# Altium project power_unit.PrjPcb
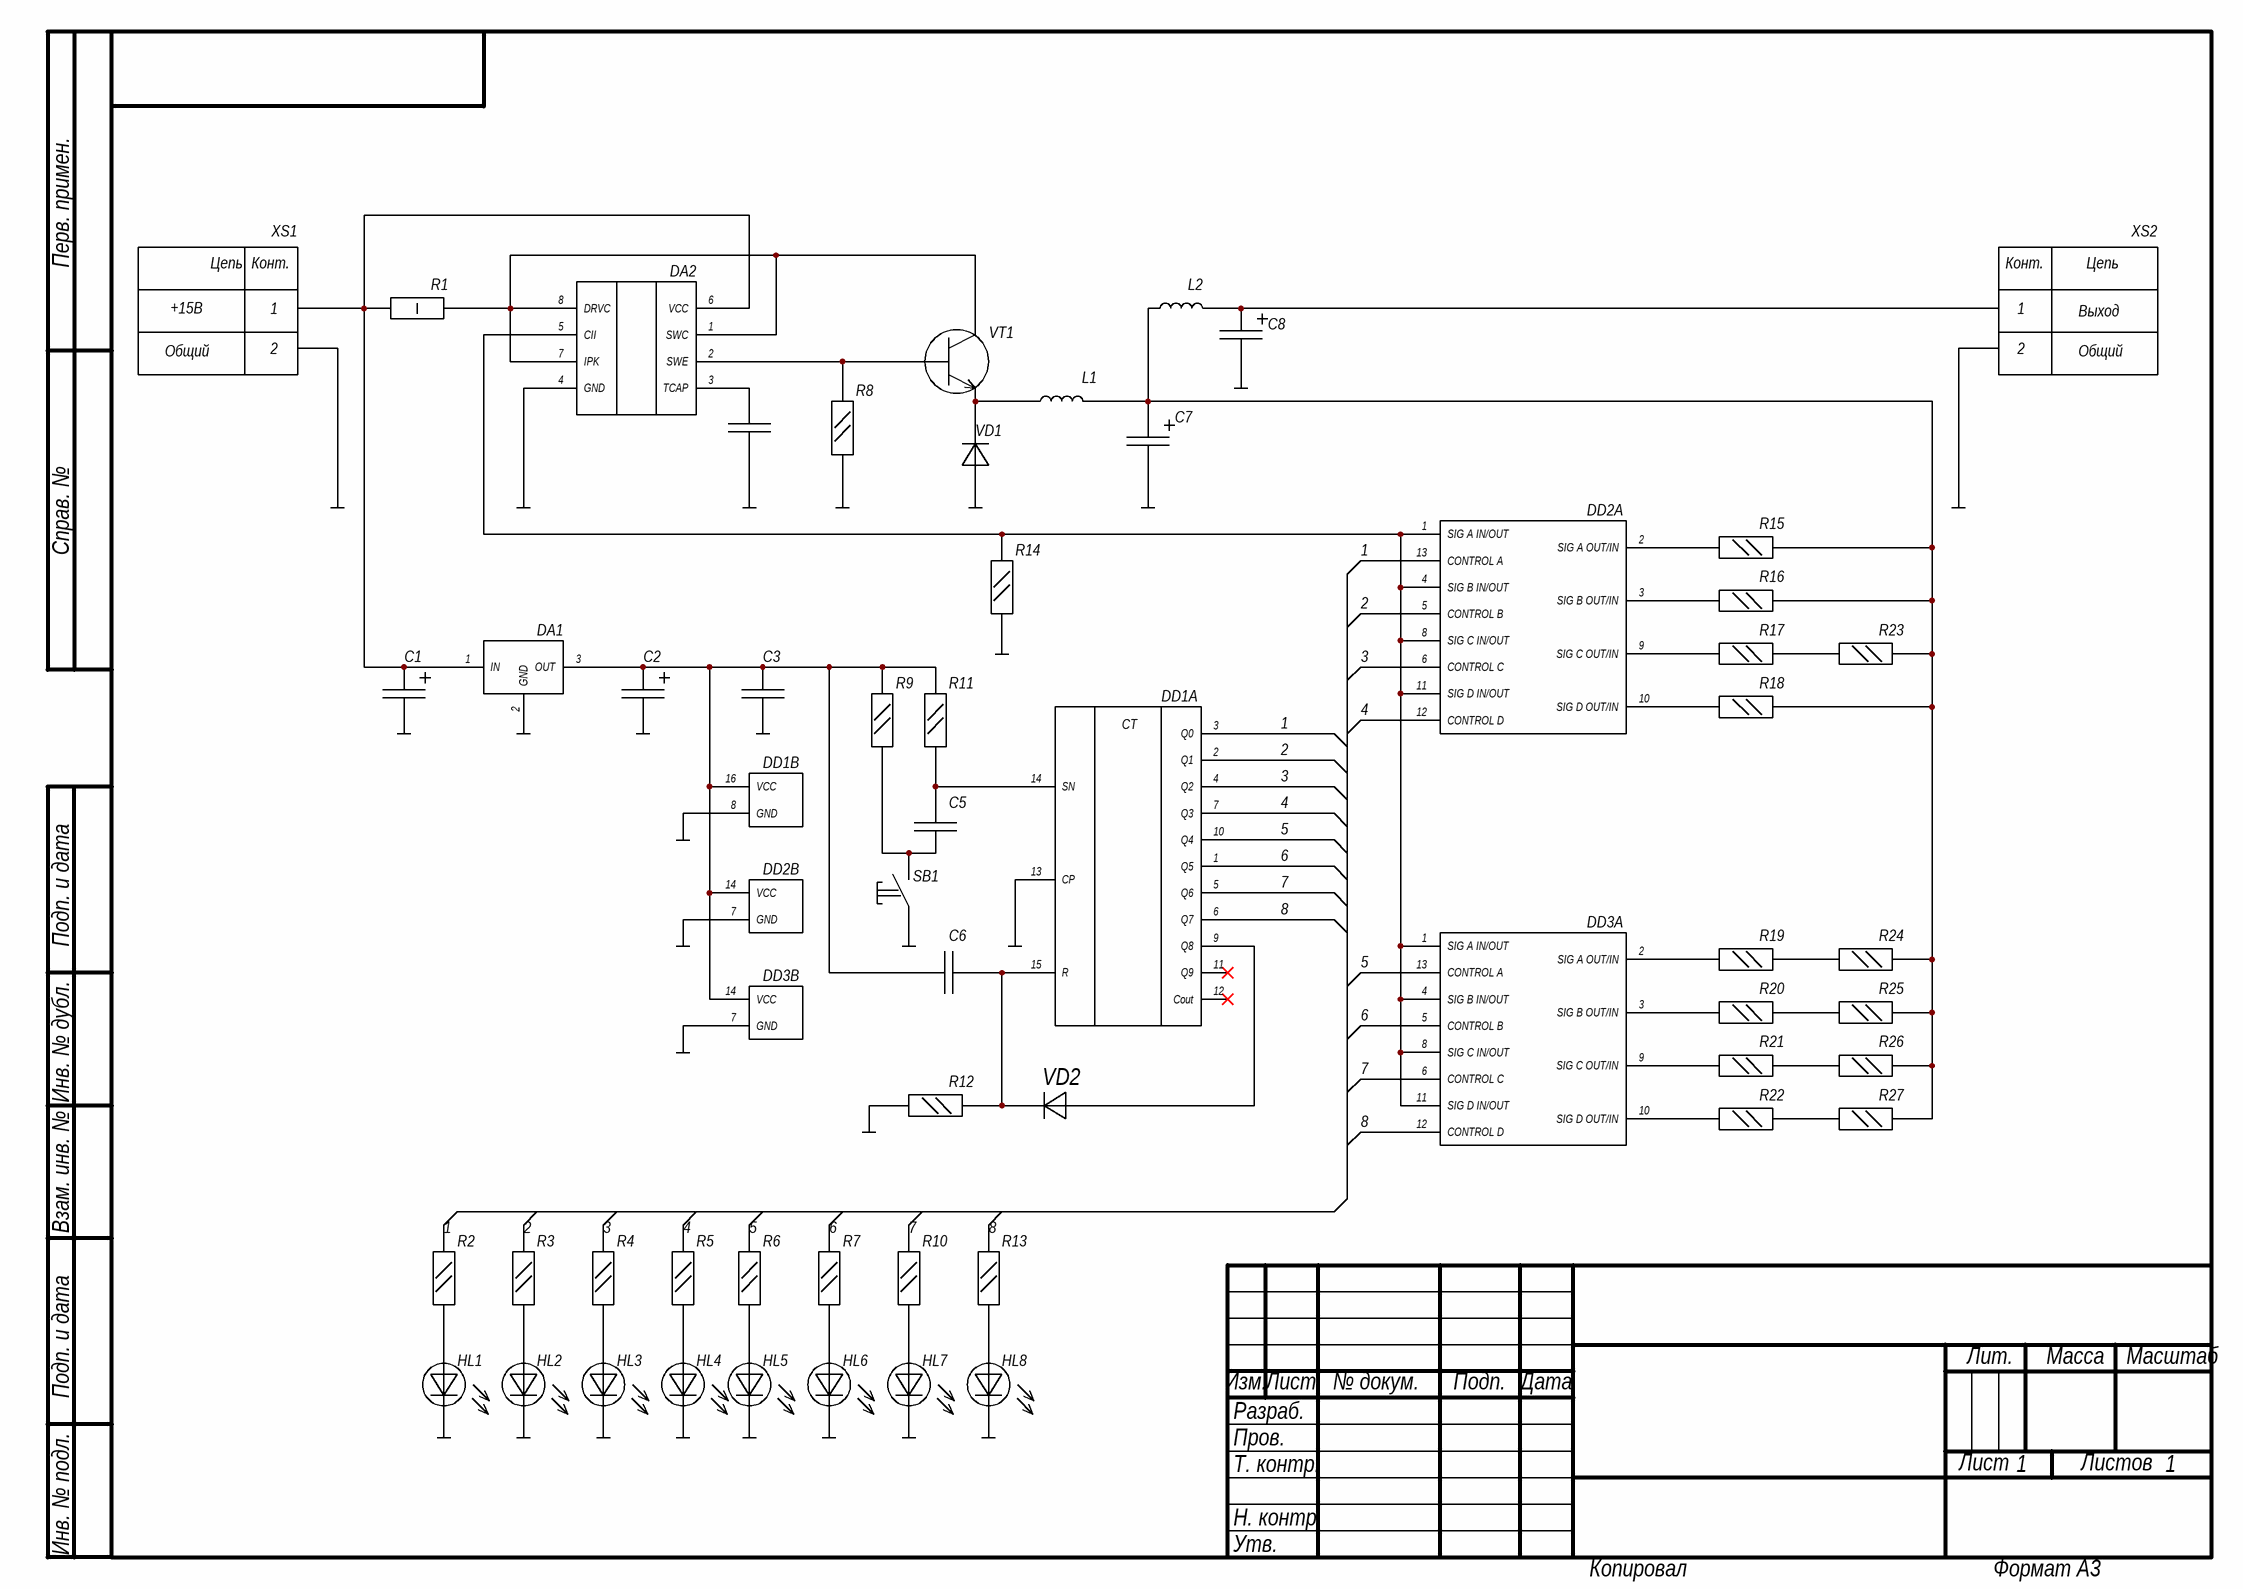
[diagram p0: Sch.SchDoc]
1 sheet, 56 parts. Net scope: global (net labels, ports and power ports of the same name join across sheets).
Board file: PCB.PcbDoc

## Sheet Sch.SchDoc
size 420 x 297 mm; SheetNumber: 1; SheetTotal: 1

### Parts
C1  100uF 25V  [CAPPR250-630X1120]  (value not drawn)
C2  100uF 25V  [CAPPR250-630X1120]  (value not drawn)
C3  Cap Ceramic 0.1uF  [CAPPRB508-450X850]  (value not drawn)
C4  Cap Ceramic 470pF  [CAPPRB508-450X850]  (value not drawn)
C5  Cap Ceramic 0.1uF  [CAPPRB508-450X850]  (value not drawn)
C6  Cap Ceramic 0.1uF  [CAPPRB508-450X850]  (value not drawn)
C7  470uF 25V  [CAPPR350-850X1300]  (value not drawn)
C8  470uF 25V  [CAPPR350-850X1300]  (value not drawn)
DA1  L7809ABV  [TO-220AB]  (value not drawn)
DA2  MC34063ABN  [DIPS8-300]  (value not drawn)
DD1  CD4017BE  [DIPS16-300]  (value not drawn)  (parts A,B of 2)
DD2  CD4066BE  [DIPS14-300]  (value not drawn)  (parts A,B of 2)
DD3  CD4066BE  [DIPS14-300]  (value not drawn)  (parts A,B of 2)
HL1  LED Red  [LD-5mm-R]  (value not drawn)
HL2  LED Red  [LD-5mm-R]  (value not drawn)
HL3  LED Red  [LD-5mm-R]  (value not drawn)
HL4  LED Red  [LD-5mm-R]  (value not drawn)
HL5  LED Red  [LD-5mm-R]  (value not drawn)
HL6  LED Red  [LD-5mm-R]  (value not drawn)
HL7  LED Red  [LD-5mm-R]  (value not drawn)
HL8  LED Red  [LD-5mm-R]  (value not drawn)
L1  КИ (КИГ) 3,0−100мкГн ±5%  [INDRD_WURTH_WE-TI]  (value not drawn)
L2  КИ (КИГ) 3,0−100мкГн ±5%  [INDRD_WURTH_WE-TI]  (value not drawn)
R1  0,1Ом  [Res 1W]  (value not drawn)
R2  1кОм  [Res 0.125W]  (value not drawn)
R3  1кОм  [Res 0.125W]  (value not drawn)
R4  1кОм  [Res 0.125W]  (value not drawn)
R5  1кОм  [Res 0.125W]  (value not drawn)
R6  1кОм  [Res 0.125W]  (value not drawn)
R7  1кОм  [Res 0.125W]  (value not drawn)
R8  22кОм  [Res 0.125W]  (value not drawn)
R9  100кОм  [Res 0.125W]  (value not drawn)
R10  1кОм  [Res 0.125W]  (value not drawn)
R11  100кОм  [Res 0.125W]  (value not drawn)
R12  100кОм  [Res 0.125W]  (value not drawn)
R13  1кОм  [Res 0.125W]  (value not drawn)
R14  1кОм  [Res 0.125W]  (value not drawn)
R15  270Ом  [Res 0.125W]  (value not drawn)
R16  1кОм  [Res 0.125W]  (value not drawn)
R17  2кОм  [Res 0.125W]  (value not drawn)
R18  3,9кОм  [Res 0.125W]  (value not drawn)
R19  4,3кОм  [Res 0.125W]  (value not drawn)
R20  5,6кОм  [Res 0.125W]  (value not drawn)
R21  7,5кОм  [Res 0.125W]  (value not drawn)
R22  9,1кОм  [Res 0.125W]  (value not drawn)
R23  100Ом  [Res 0.125W]  (value not drawn)
R24  200Ом  [Res 0.125W]  (value not drawn)
R25  200Ом  [Res 0.125W]  (value not drawn)
R26  100Ом  [Res 0.125W]  (value not drawn)
R27  300Ом  [Res 0.125W]  (value not drawn)
SB1  Button SMD  [Button SMD]  (value not drawn)
VD1  1N5820  [DO-27]  (value not drawn)
VD2  1N4002  [DO-35]  (value not drawn)
VT1  TIP121G  [TO-220AB]  (value not drawn)
XS1  Power Connector 2 pin  [WIELAND_25.161.0253.0]  (value not drawn)
XS2  Power Connector 2 pin  [WIELAND_25.161.0253.0]  (value not drawn)

### Nets
GND: C1.2 C2.2 C3.2 C4.2 C7.2 C8.2 DA1.2(GND) DA2.4(GND) DD1.8(GND) DD1.13(CP) DD2.7(GND) DD3.7(GND) HL1.2(K) HL2.2(K) HL3.2(K) HL4.2(K) HL5.2(K) HL6.2(K) HL7.2(K) HL8.2(K) R8.1 R12.1 R14.1 SB1.1 VD1.1(А) XS1.2 XS2.2
1: DD1.3(Q0) DD2.13(CONTROL_A)
2: DD1.2(Q1) DD2.5(CONTROL_B)
3: DD1.4(Q2) DD2.6(CONTROL_C)
4: DD1.7(Q3) DD2.12(CONTROL_D)
5: DD1.10(Q4) DD3.13(CONTROL_A)
6: DD1.1(Q5) DD3.5(CONTROL_B)
7: DD1.5(Q6) DD3.6(CONTROL_C)
8: DD1.6(Q7) DD3.12(CONTROL_D)
NetC1_1: C1.1 DA1.1(IN) DA2.6(VCC) R1.2 XS1.1
NetC2_1: C2.1 C3.1 C6.1 DA1.3(OUT) DD1.16(VCC) DD2.14(VCC) DD3.14(VCC) R9.2 R11.2
NetC4_1: C4.1 DA2.3(TCAP)
NetC5_1: C5.1 DD1.14(SN) R11.1
NetC5_2: C5.2 R9.1 SB1.2
NetC6_2: C6.2 DD1.15(R) R12.2 VD2.2(К)
NetC7_1: C7.1 L1.2 L2.1 R15.2 R16.2 R18.2 R23.2 R24.2 R25.2 R26.2 R27.2
NetC8_1: C8.1 L2.2 XS2.1
NetDA2_1: DA2.1(SWC) DA2.7(IPK) DA2.8(DRVC) R1.1 VT1.2(К)
NetDA2_2: DA2.2(SWE) R8.2 VT1.1(Б)
NetDA2_5: DA2.5(CII) DD2.1(SIG_A_IN/OUT) DD2.4(SIG_B_IN/OUT) DD2.8(SIG_C_IN/OUT) DD2.11(SIG_D_IN/OUT) DD3.1(SIG_A_IN/OUT) DD3.4(SIG_B_IN/OUT) DD3.8(SIG_C_IN/OUT) DD3.11(SIG_D_IN/OUT) R14.2
NetDD1_9: DD1.9(Q8) VD2.1(А)
NetDD2_2: DD2.2(SIG_A_OUT/IN) R15.1
NetDD2_3: DD2.3(SIG_B_OUT/IN) R16.1
NetDD2_9: DD2.9(SIG_C_OUT/IN) R17.1
NetDD2_10: DD2.10(SIG_D_OUT/IN) R18.1
NetDD3_2: DD3.2(SIG_A_OUT/IN) R19.1
NetDD3_3: DD3.3(SIG_B_OUT/IN) R20.1
NetDD3_9: DD3.9(SIG_C_OUT/IN) R21.1
NetDD3_10: DD3.10(SIG_D_OUT/IN) R22.1
NetHL1_1: HL1.1(A) R2.1
NetHL2_1: HL2.1(A) R3.1
NetHL3_1: HL3.1(A) R4.1
NetHL4_1: HL4.1(A) R5.1
NetHL5_1: HL5.1(A) R6.1
NetHL6_1: HL6.1(A) R7.1
NetHL7_1: HL7.1(A) R10.1
NetHL8_1: HL8.1(A) R13.1
NetL1_1: L1.1 VD1.2(К) VT1.3(Э)
NetR17_2: R17.2 R23.1
NetR19_2: R19.2 R24.1
NetR20_2: R20.2 R25.1
NetR21_2: R21.2 R26.1
NetR22_2: R22.2 R27.1

Not connected (* = marked no-connect by the designer): DD1 11(Q9)* 12(Cout)*; R2 2; R3 2; R4 2; R5 2; R6 2; R7 2; R10 2; R13 2

### Notes on the sheet
- +15В
- Выход
- Общий
- Labels drawn without touching a wire or pin: 1, 2, 3, 4, 5, 6, 7, 8
- Перв. примен.
- Справ. №
- Подп. и дата
- Инв. № дубл.
- Взам. инв. №
- Разраб.
- Изм.
- Лист
- № докум.
- Подп.
- Дата
- Лит.
- Масса
- Масштаб
- Пров.
- Т. контр.
- Листов
- Инв. № подл.
- Н. контр.
- Утв.
- Копировал
- Формат А3
- (in symbol CD4017BE, part A) СТ
- (in symbol Power Connector 2 pin) Цепь; Конт.

### Library data of the parts
C1 C2 = Cap Polarity 100uF 25V: ECAP TKR101M1EE11 25В 100мкФ ±5% (Jamicon, Китай); Type: Конденсатор
C3 C5 C6 = Cap Ceramic 0.1uF: CAP X7R RDER71H104K 25В 0.1мкФ ±10% (Murata, Япония); Type: Конденсатор
C4 = Cap Ceramic 470pF: CAP NPO RDE5C1H471J 25В 470пкФ ±5% (Murata, Япония); Type: Конденсатор
C7 C8 = Cap Polarity 470uF 25V: ECAP TKR471M1EF14 25В 470мкФ ±5% (Jamicon, Китай); Type: Конденсатор
DA1 = L7809ABV: L7809ABV (STMicroelectronics, Швейцария)
DA2 = MC34063ABN: MC34063ABN (STMicroelectronis, Швейцария)
DD1 = CD4017BE: CD4017BE (Texas Instuments, США)
DD2 DD3 = CD4066BE: CD4066BE (HGSEMI, Китай)
HL1-HL8 = LED Red: GNL-5012ED (G-nor Electronics, Китай)
L1 L2 = Inductor КИ (КИГ) 3,0−100мкГн ±5%: КИ (КИГ) 3,0−100мкГн ±10% (Россия)
R1 = Res 0,1 1W: С1-4−1−0,1Ом ±5% (Россия)
R2-R7 R10 R13 = Res 1K 0.125W: С1-4−0,125−1кОм ±5% (Россия)
R8 = Res 22K 0.125W: С1-4−0,125−22кОм ±5% (Россия)
R9 R11 R12 = Res 100K 0.125W: С1-4−0,125−100кОм ±5% (Россия)
R14 R16 = Res 1,5K 0.125W: С1-4−0,125−1,5кОм ±5% (Россия)
R15 = Res 270 0.125W: С1-4−0,125−270Ом ±5% (Россия)
R17 = Res 2K 0.125W: С1-4−0,125−2кОм ±5% (Россия)
R18 = Res 3,9K 0.125W: С1-4−0,125−3,9кОм ±5% (Россия)
R19 = Res 4,3K 0.125W: С1-4−0,125−4,3кОм ±5% (Россия)
R20 = Res 5,6K 0.125W: С1-4−0,125−5,6кОм ±5% (Россия)
R21 = Res 7,5K 0.125W: С1-4−0,125−7,5кОм ±5% (Россия)
R22 = Res 9,1K 0.125W: С1-4−0,125−9,1кОм ±5% (Россия)
R23 R26 = Res 100 0.125W: С1-4−0,125−100Ом ±5% (Россия)
R24 R25 = Res 200 0.125W: С1-4−0,125−200Ом ±5% (Россия)
R27 = Res 300 0.125W: С1-4−0,125−300Ом ±5% (Россия)
SB1 = Button: Кнопка тактовая 1437566-3 (TE Connectivity, США)
VD1 = Diode 1N5820: 1N5820 (Diotec, Германия)
VD2 = Diode 1N4148: 1N4148 (Diotec, Германия); Type: Диод; Published: 18.05.2010; Publisher: Andrew Danich
VT1 = Transistor TIP121G: TIP121G (ON Semiconductor, США)
XS1 XS2 = Power Connector 2 pin: 25.161.0253.0 (Wieland Electric, Германия)